# Altium schematic sheet Screen_PCB_250214.SchDoc
size A4; Date: 2025-7-12; DrawnBy: 曹子建; Time: 2025-7-12
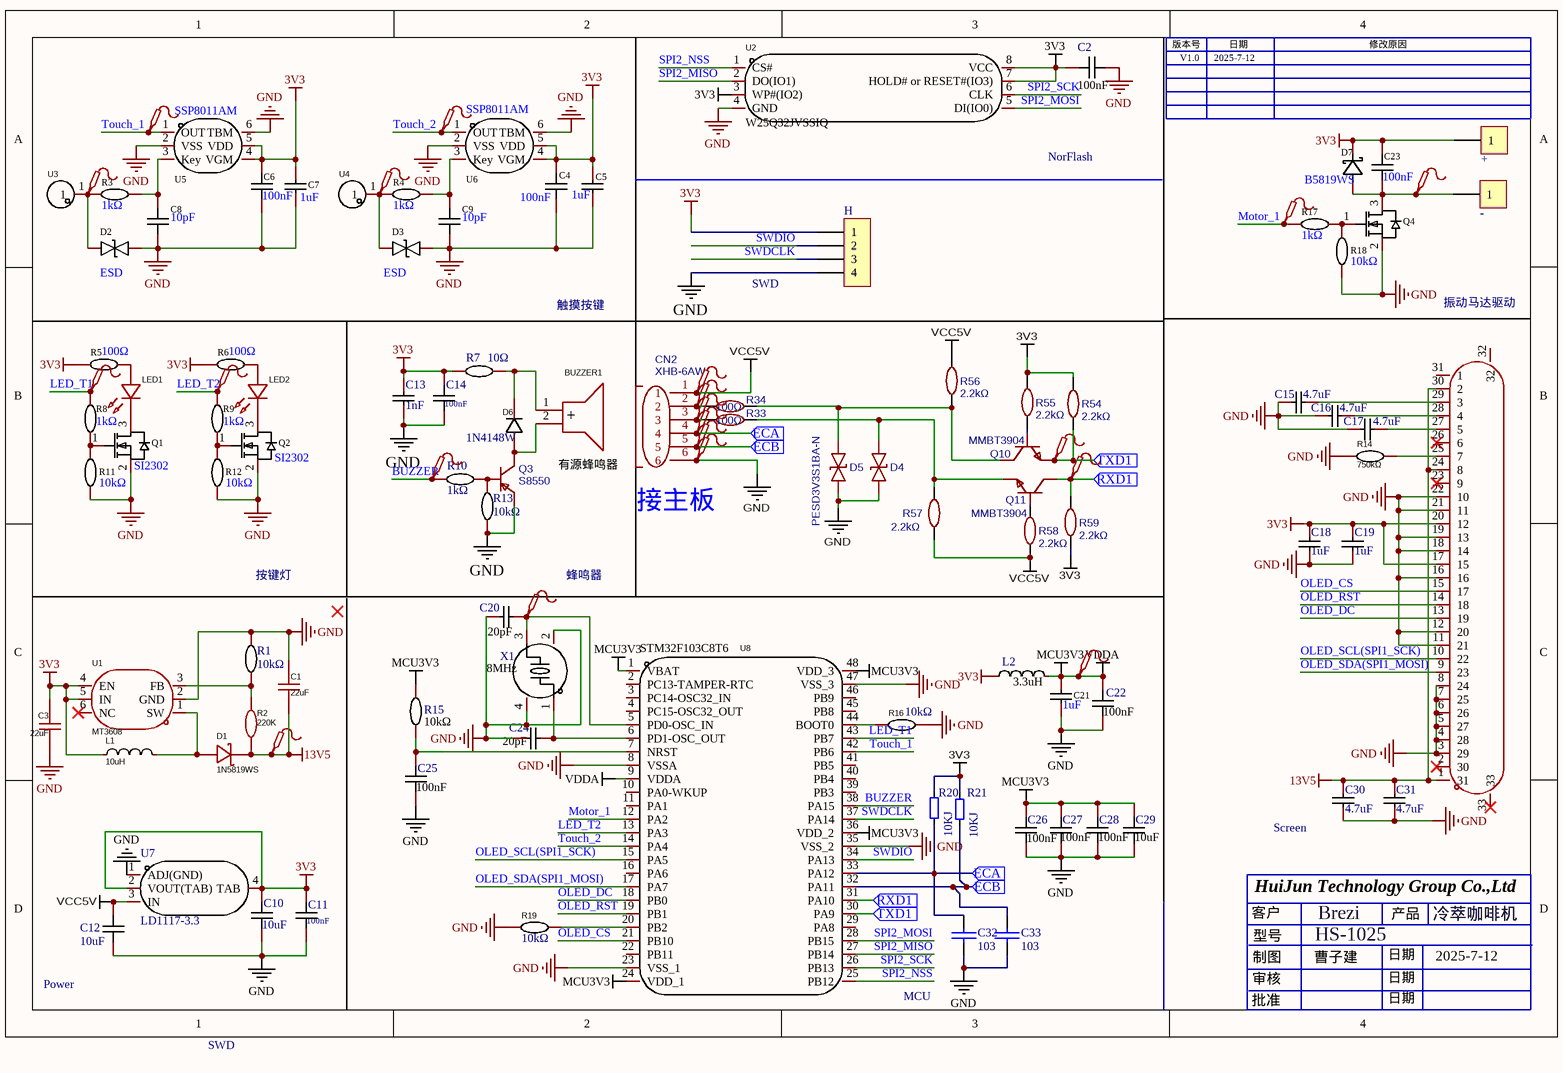
[diagram p0: Screen_PCB_250214.SchDoc]

## Parts
BUZZER1  3kHz  [BUZ-TH_BD9.0-P5.00-D0.6-FD]  (value not drawn)
C1  22uF  [C0603]
C2  Symbol: 100nF  [C0603]  (hidden comment: CL10B104KB8NNNC)
C3  22uF  [C0603]
C4  Symbol: 100nF  [C0603]  (hidden comment: CL10B104KB8NNNC)
C5  Name: 1uF  [C0603]  (hidden comment: 0603B105K250NT)
C6  Symbol: 100nF  [C0603]  (hidden comment: CL10B104KB8NNNC)
C7  Name: 1uF  [C0603]  (hidden comment: 0603B105K250NT)
C8  value 10pF  [C0603]  (hidden comment: 0603CG100J500NT)
C9  value 10pF  [C0603]  (hidden comment: 0603CG100J500NT)
C10  Name: 10uF  [C0805]  (hidden comment: CL21A226MAQNNNE_C45783)
C11  Symbol: 100nF  [C0603]  (hidden comment: CL10B104KB8NNNC)
C12  Name: 10uF  [C0805]  (hidden comment: CL21A226MAQNNNE_C45783)
C13  Name: 1nF  [C0603]  (hidden comment: CC0603KRX7R9BB102)
C14  Symbol: 100nF  [C0603]  (hidden comment: CL10B104KB8NNNC)
C15  Name: 4.7uF  [C0805]  (hidden comment: CL21B475KAFNNNE)
C16  Name: 4.7uF  [C0805]  (hidden comment: CL21B475KAFNNNE)
C17  Name: 4.7uF  [C0805]  (hidden comment: CL21B475KAFNNNE)
C18  Name: 1uF  [C0603]  (hidden comment: 0603B105K250NT)
C19  Name: 1uF  [C0603]  (hidden comment: 0603B105K250NT)
C20  Name: 20pF  [C0603]  (hidden comment: CC0603JRNPO9BN200)
C21  Name: 1uF  [C0603]  (hidden comment: 0603B105K250NT)
C22  Symbol: 100nF  [C0603]  (hidden comment: CL10B104KB8NNNC)
C23  Symbol: 100nF  [C0603]  (hidden comment: CL10B104KB8NNNC)
C24  Name: 20pF  [C0603]  (hidden comment: CC0603JRNPO9BN200)
C25  Symbol: 100nF  [C0603]  (hidden comment: CL10B104KB8NNNC)
C26  Symbol: 100nF  [C0603]  (hidden comment: CL10B104KB8NNNC)
C27  Symbol: 100nF  [C0603]  (hidden comment: CL10B104KB8NNNC)
C28  Symbol: 100nF  [C0603]  (hidden comment: CL10B104KB8NNNC)
C29  Name: 10uF  [C0603]  (hidden comment: CL10A106KP8NNNC)
C30  Name: 4.7uF  [C0805]  (hidden comment: CL21B475KAFNNNE)
C31  Name: 4.7uF  [C0805]  (hidden comment: CL21B475KAFNNNE)
C32  103  [C0603]
C33  103  [C0603]
CN2  XHB-6AW  [CONN-SMD_6P-P1.25_HC-1.25-6PLT]
D1  1N5819WS  [SOD-323_L1.8-W1.3-LS2.5-RD]
D2  Type: ESD  [D0603-BI]  (hidden comment: BESDU0603-14)
D3  Type: ESD  [D0603-BI]  (hidden comment: BESDU0603-14)
D4  PESD3V3S1BA-N  [SOD-523_L1.2-W0.8-LS1.6-BI]
D5  PESD3V3S1BA-N  [SOD-523_L1.2-W0.8-LS1.6-BI]  (value not drawn)
D6  1N4148W  [SOD-123_L2.8-W1.8-LS3.7-RD]
D7  B5819WS  [SOD-323_L1.7-W1.3-LS2.5-FD]
FPC1  0.3K-HX-31PWB  [FPC-SMD_31P-P0.30_HDGC_0.3K-HX-31PWB]  (value not drawn)
H  CON4  [SIP4-2.54]  (value not drawn)
L1  10uH  [IND-SMD_L4.0-W4.0]
L2  Name: 3.3uH  [L0603]  (hidden comment: MLF1608A3R3JT000)
LED1  67-21S/KK7C-H507034Z15/DT(GC)  [LED-SMD_L3.5-W2.8-FD-2835_WHITE]  (value not drawn)
LED2  67-21S/KK7C-H507034Z15/DT(GC)  [LED-SMD_L3.5-W2.8-FD-2835_WHITE]  (value not drawn)
Q1  SI2302  [SOT-23_L2.9-W1.3-P1.90-LS2.4-BR]
Q2  SI2302  [SOT-23_L2.9-W1.3-P1.90-LS2.4-BR]
Q3  S8550  [SOT-23_L2.9-W1.3-P0.95-LS2.4-BR]
Q4  SI2302_C2938373  [SOT-23_L2.9-W1.3-P1.90-LS2.4-BR]  (value not drawn)
Q10  MMBT3904  [SOT-23-3_L2.9-W1.3-P1.90-LS2.4-BR]
Q11  MMBT3904  [SOT-23-3_L2.9-W1.3-P1.90-LS2.4-BR]
R1  Name: 10kΩ  [R0603]  (hidden comment: 180kΩ)
R2  220K  [R0603]
R3  Name: 1kΩ  [R0603]  (hidden comment: RC0603FR-071KL)
R4  Name: 1kΩ  [R0603]  (hidden comment: RC0603FR-071KL)
R5  Name: 100Ω  [R0603]  (hidden comment: RC0603FR-07100RL)
R6  Name: 100Ω  [R0603]  (hidden comment: RC0603FR-07100RL)
R7  Name: 10Ω  [R0603]  (hidden comment: 0603WAF100JT5E)
R8  Name: 1kΩ  [R0603]  (hidden comment: RC0603FR-071KL)
R9  Name: 1kΩ  [R0603]  (hidden comment: RC0603FR-071KL)
R10  1kΩ  [R0603]
R11  10kΩ  [R0603]
R12  10kΩ  [R0603]
R13  10kΩ  [R0603]
R14  value 750kΩ  [R0603]  (hidden comment: 0603WAF7503T5E)
R15  10kΩ  [R0603]
R16  value 10kΩ  [R0603]  (hidden comment: 0603WAF1002T5E)
R17  Name: 1kΩ  [R0603]  (hidden comment: RC0603FR-071KL)
R18  10kΩ  [R0603]
R19  value 10kΩ  [R0603]  (hidden comment: 0603WAF1002T5E)
R20  10KJ  [R0603]
R21  10KJ  [R0603]
R33  100Ω  [R0603]
R34  100Ω  [R0603]
R54  2.2kΩ  [R0603]
R55  2.2kΩ  [R0603]
R56  2.2kΩ  [R0603]
R57  2.2kΩ  [R0603]
R58  2.2kΩ  [R0603]
R59  2.2kΩ  [R0603]
T1  +  [1.5MM测试点]
T2  -  [1.5MM测试点]
TP1  Test-Point  [Test-Point-0.5mm]  (value not drawn)
TP2  Test-Point  [Test-Point-0.5mm]  (value not drawn)
TP3  Test-Point  [Test-Point-0.5mm]  (value not drawn)
TP4  Test-Point  [Test-Point-0.5mm]  (value not drawn)
TP5  Test-Point  [Test-Point-0.5mm]  (value not drawn)
TP6  Test-Point  [Test-Point-0.5mm]  (value not drawn)
TP7  Test-Point  [Test-Point-0.5mm]  (value not drawn)
TP8  Test-Point  [Test-Point-0.5mm]  (value not drawn)
TP9  Test-Point  [Test-Point-0.5mm]  (value not drawn)
TP10  Test-Point  [Test-Point-0.5mm]  (value not drawn)
TP11  Test-Point  [Test-Point-0.5mm]  (value not drawn)
TP12  Test-Point  [Test-Point-0.5mm]  (value not drawn)
TP13  Test-Point  [Test-Point-0.5mm]  (value not drawn)
TP15  Test-Point  [Test-Point-0.5mm]  (value not drawn)
TP16  Test-Point  [Test-Point-0.5mm]  (value not drawn)
TP17  Test-Point  [Test-Point-0.5mm]  (value not drawn)
TP18  Test-Point  [Test-Point-0.5mm]  (value not drawn)
TP19  Test-Point  [Test-Point-0.5mm]  (value not drawn)
TP20  Test-Point  [Test-Point-0.5mm]  (value not drawn)
TP21  Test-Point  [Test-Point-0.5mm]  (value not drawn)
U1  MT3608  [SOT-23-6_L2.9-W1.6-P0.95-LS2.8-BL]
U2  W25Q32JVSSIQ  [SOIC-8_L5.3-W5.3-P1.27-LS8.0-BL]
U3  F10-8-7-0.4  [F6.5-10-4.5-0.5Z]  (value not drawn)
U4  F10-8-7-0.4  [F6.5-10-4.5-0.5Z]  (value not drawn)
U5  SSP8011AM  [SOT-23-6_L2.9-W1.7-P0.95-LS2.8-BL]
U6  SSP8011AM  [SOT-23-6_L2.9-W1.7-P0.95-LS2.8-BL]
U7  LD1117-3.3  [SOT-223_L6.7-W3.5-P2.30-BR]
U8  STM32F103C8T6  [LQFP-48_L7.0-W7.0-P0.50-LS9.0-BL]
X1  Name: 8MHz  [CRYSTAL-SMD_4P-L3.2-W2.5-BL]  (hidden comment: X32258MSB4SI)

## Ports
ECA (in), ECB (in), RXD1 (in), TXD1 (in)

## Nets
3V3: C2.2 C3.2 C4.2 C5.2 C6.2 C7.2 C10.2 C11.1 C13.2 C14.1 C18.2 C19.2 C23.1 D7.2(K) FPC1.17(15) FPC1.20(12) H.1 L1.1 L2.1 R5.2 R6.2 R7.1 R20.1 R21.2 R54.2 R55.2 R59.1 T1.1 U1.4(EN) U1.5(IN) U2.3(WP#(IO2)) U2.7(HOLD#_or_RESET#(IO3)) U2.8(VCC) U5.4(VGM) U5.5(VDD) U6.4(VGM) U6.5(VDD) U7.2(VOUT(TAB)) U7.4(TAB)
13V5: C1.1 C30.2 C31.2 D1.1(K) FPC1.1(31) FPC1.24(8) FPC1.30(2) R2.1 TP21.1
GND: C1.2 C2.1 C3.1 C4.1 C5.1 C6.1 C7.1 C8.1 C9.1 C10.1 C11.2 C12.1 C13.1 C14.2 C15.1 C16.1 C17.1 C18.1 C19.1 C20.1 C21.1 C22.1 C24.1 C25.1 C26.1 C27.1 C28.1 C29.1 C30.1 C31.1 C32.2 C33.2 CN2.6 D2.2 D3.2 D4.1 D5.1 FPC1.3(29) FPC1.4(28) FPC1.5(27) FPC1.6(26) FPC1.7(25) FPC1.8(24) FPC1.11(21) FPC1.12(20) FPC1.16 FPC1.18(14) FPC1.19(13) FPC1.21(11) FPC1.22(10) H.4 Q1.2(S) Q2.2(S) Q3.2(E) Q4.2(S) R1.2 R11.2 R12.2 R13.2 R14.1 R16.1 R18.2 R19.1 TP6.1 U1.2(GND) U2.4(GND) U5.2(VSS) U5.6(TBM) U6.2(VSS) U6.6(TBM) U7.1(ADJ(GND)) U8.8(VSSA) U8.23(VSS_1) U8.35(VSS_2) U8.47(VSS_3) X1.2(GND) X1.4(GND)
MCU3V3: C21.2 C22.2 C26.2 C27.2 C28.2 C29.2 L2.2 R15.1 TP7.1 U8.1(VBAT) U8.9(VDDA) U8.24(VDD_1) U8.36(VDD_2) U8.48(VDD_3)  [also labelled VDDA]
VCC5V: C12.2 CN2.1 R56.2 R57.1 R58.1 TP1.1 U7.3(IN)
BUZZER: R10.1 TP11.1 U8.38(PA15)
ECA: C32.1 CN2.4 R20.2 TP4.1 U8.33(PA12) ; port ECA
ECB: C33.1 CN2.5 R21.1 TP5.1 U8.32(PA11) ; port ECB
LED_T1: R8.2 TP13.1 U8.43(PB7)
LED_T2: R9.2 TP12.1 U8.13(PA3)
Motor_1: R17.1 TP16.1 U8.12(PA2)
OLED_CS: FPC1.15(17) U8.21(PB10)
OLED_DC: FPC1.13(19) U8.18(PB0)
OLED_RST: FPC1.14(18) U8.19(PB1)
OLED_SCL(SPI1_SCK): FPC1.10(22) U8.15(PA5)
OLED_SDA(SPI1_MOSI): FPC1.9(23) U8.17(PA7)
RXD1: Q11.3(C) R59.2 TP9.1 U8.31(PA10) ; port RXD1
SPI2_MISO: U2.2(DO(IO1)) U8.27(PB14)
SPI2_MOSI: U2.5(DI(IO0)) U8.28(PB15)
SPI2_NSS: U2.1(CS#) U8.25(PB12)
SPI2_SCK: U2.6(CLK) U8.26(PB13)
SWDCLK: H.3 U8.37(PA14)
SWDIO: H.2 U8.34(PA13)
Touch_1: TP18.1 U5.1(OUT) U8.42(PB6)
Touch_2: TP20.1 U6.1(OUT) U8.14(PA4)
TXD1: Q10.2(E) R54.1 TP8.1 U8.30(PA9) ; port TXD1
NetBUZZER1_1: BUZZER1.1(+) D6.1(K) R7.2
NetBUZZER1_2: BUZZER1.2(-) D6.2(A) Q3.3(C)
NetC8_2: C8.2 R3.2 U5.3(Key)
NetC9_2: C9.2 R4.2 U6.3(Key)
NetC15_2: C15.2 FPC1.29(3)
NetC16_2: C16.2 FPC1.28(4)
NetC17_2: C17.2 FPC1.27(5)
NetC20_2: C20.2 TP10.1 U8.5(PD0-OSC_IN) X1.3
NetC23_2: C23.2 D7.1(A) Q4.3(D) T2.1 TP15.1
NetC24_2: C24.2 U8.6(PD1-OSC_OUT) X1.1
NetC25_2: C25.2 R15.2 U8.7(NRST)
NetCN2_2: CN2.2 R34.1 TP2.1
NetCN2_3: CN2.3 R33.1 TP3.1
NetD1_2: D1.2(A) L1.2 U1.1(SW)
NetD2_1: D2.1 R3.1 TP17.1 U3.1
NetD3_1: D3.1 R4.1 TP19.1 U4.1
NetD4_2: D4.2 Q11.2(E) R33.2 R57.2
NetD5_2: D5.2 Q10.3(C) R34.2 R56.1
NetFPC1_25: FPC1.25(7) R14.2
NetLED1_1: LED1.1 Q1.3(D)
NetLED1_2: LED1.2 R5.1
NetLED2_1: LED2.1 Q2.3(D)
NetLED2_2: LED2.2 R6.1
NetQ1_1: Q1.1(G) R8.1 R11.1
NetQ2_1: Q2.1(G) R9.1 R12.1
NetQ3_1: Q3.1(B) R10.2 R13.1
NetQ4_1: Q4.1(G) R17.2 R18.1
NetQ10_1: Q10.1(B) R55.1
NetQ11_1: Q11.1(B) R58.2
NetR1_1: R1.1 R2.2 U1.3(FB)
NetR16_2: R16.2 U8.44(BOOT0)
NetR19_2: R19.2 U8.20(PB2)

Not connected (* = marked no-connect by the designer): FPC1 2(30)* 23(9)* 26(6)* 31(1) 32 33*; U1 6(NC)*; U8 2(PC13-TAMPER-RTC) 3(PC14-OSC32_IN) 4(PC15-OSC32_OUT) 10(PA0-WKUP) 11(PA1) 16(PA6) 22(PB11) 29(PA8) 39(PB3) 40(PB4) 41(PB5) 45(PB8) 46(PB9)

## Notes on the sheet
- NorFlash
- 触摸按键
- SWD
- (near FPC1) 振动马达驱动
- 有源蜂鸣器
- 接主板
- 按键灯
- 蜂鸣器
- (near C30) Screen
- Brezi
- 冷萃咖啡机
- (near C12) Power
- HS-1025
- MCU
- 版本号
- 日期
- 修改原因
- V1.0
- 客户
- HuiJun Technology Group Co.,Ltd
- 产品
- 审核
- 制图
- 型号
- 批准

## Library data of the parts
BUZZER1 = HNB09A03: Manufacturer: 华能; Add into BOM: yes; Oscillator Circuit: 有源(内含驱动线路); Technology Type: 电磁式; Operating Voltage: 1.5V~4.5V; Current Consumption: 30mA; Sound Pressure Level (SPL): 85dB@10cm; Symbol: HNB09A03; Device: HNB09A03; LCSC Part Name: 电磁式有源一体蜂鸣器HNB09A03; Supplier Part: C96102; Manufacturer Part: HNB09A03; Supplier Footprint: 插件,D=9mm; JLCPCB Part Class: Extended Part; Datasheet: https://atta.szlcsc.com/upload/public/pdf/source/20170522/1495448326172.pdf; Supplier: LCSC; Convert to PCB: yes; Value: 3kHz; Diameter (φD): 9mm; Length: -; Width: -; Height: 5.5mm; Operating Temperature: -20℃~+70℃
C1 C3 = HGC0603R5226M100NTHJ: Manufacturer: Chinocera(华瓷); Add into BOM: yes; Tolerance: ±20%; Voltage Rated: 10V; Temperature Coefficient: X5R; Symbol: HGC0603R5226M100NTHJ; Device: HGC0603R5226M100NTHJ; Supplier Part: C7432770; Manufacturer Part: HGC0603R5226M100NTHJ; Supplier Footprint: 0603; JLCPCB Part Class: Extended Part; Datasheet: https://atta.szlcsc.com/upload/public/pdf/source/20240320/FAC3FEC40A78BC5CCCE96C232A94D860.pdf; Supplier: LCSC; Convert to PCB: yes; Value: 22uF
  C1: LCSC Part Name: 22uF ±20% 16V
  C3: LCSC Part Name: 22uF ±20% 10V
C2 C4 C6 C11 C14 C22 C23 C25-C28 = CL10B104KB8NNNC: Manufacturer: SAMSUNG(三星); Convert to PCB: yes; value: 100nF; Name: CL10B104KB8NNNC; Device: CL10B104KB8NNNC; Supplier: LCSC; Manufacturer Part: CL10B104KB8NNNC; Supplier Part: C1591; JLCPCB Part Class: Extended Part; Add into BOM: yes; Origin Footprint: C0603
C5 C7 C18 C19 C21 = 0603B105K250NT: Manufacturer: FH(风华); Add into BOM: yes; Value: 1uF; Tolerance: ±10%; Voltage Rated: 25V; Temperature Coefficient: X7R; Symbol: 0603B105K250NT; Device: 0603B105K250NT; LCSC Part Name: 1uF ±10% 25V; Supplier Part: C59302; Manufacturer Part: 0603B105K250NT; Supplier Footprint: 0603; JLCPCB Part Class: 扩展库; Datasheet: https://atta.szlcsc.com/upload/public/pdf/source/20170923/C59302_1506149498957988854.pdf; Supplier: LCSC; Convert to PCB: yes
C8 C9 = 0603CG100J500NT: Manufacturer: FH(风华); Add into BOM: yes; Tolerance: ±5%; Voltage Rated: 50V; Temperature Coefficient: C0G; Symbol: 0603CG100J500NT; Device: 0603CG100J500NT; LCSC Part Name: 10pF ±5% 50V; Supplier Part: C91367; Manufacturer Part: 0603CG100J500NT; Supplier Footprint: 0603; JLCPCB Part Class: Extended Part; Datasheet: https://atta.szlcsc.com/upload/public/pdf/source/20200305/C486355_26A10D38EF8C2A5C37091D0039909270.pdf; Supplier: LCSC; Convert to PCB: yes
C10 C12 = CL21A226MAQNNNE_C45783: Manufacturer: SAMSUNG(三星); Add into BOM: yes; Value: 10uF; Tolerance: ±20%; Voltage Rated: 25V; Temperature Coefficient: X5R; Symbol: CL21A226MAQNNNE; Device: CL21A226MAQNNNE_C45783; LCSC Part Name: 22uF ±20% 25V; Supplier Part: C45783; Manufacturer Part: CL21A226MAQNNNE; Supplier Footprint: 0805; JLCPCB Part Class: Basic Part; Datasheet: https://atta.szlcsc.com/upload/public/pdf/source/20160103/1457707727161.pdf; Supplier: LCSC; Convert to PCB: yes
C13 = CC0603KRX7R9BB102: Manufacturer: YAGEO(国巨); Add into BOM: yes; Value: 1nF; Tolerance: ±10%; Voltage Rated: 50V; Temperature Coefficient: X7R; Symbol: CC0603KRX7R9BB102; Device: CC0603KRX7R9BB102; LCSC Part Name: 1nF ±10% 50V; Supplier Part: C100040; Manufacturer Part: CC0603KRX7R9BB102; Supplier Footprint: 0603; JLCPCB Part Class: Extended Part; Datasheet: https://atta.szlcsc.com/upload/public/pdf/source/20170420/1492670664651.pdf; Supplier: LCSC; Convert to PCB: yes
C15-C17 C30 C31 = CL21B475KAFNNNE: Manufacturer: SAMSUNG(三星); Add into BOM: yes; Value: 4.7uF; Tolerance: ±10%; Voltage Rated: 25V; Temperature Coefficient: X7R; Symbol: CL21B475KAFNNNE; Device: CL21B475KAFNNNE; LCSC Part Name: 4.7uF ±10% 25V; Supplier Part: C98195; Manufacturer Part: CL21B475KAFNNNE; Supplier Footprint: 0805; JLCPCB Part Class: Extended Part; Datasheet: https://atta.szlcsc.com/upload/public/pdf/source/20170412/1491969153531.pdf; Supplier: LCSC; Convert to PCB: yes
C20 C24 = CC0603JRNPO9BN200: Manufacturer: YAGEO(国巨); Add into BOM: yes; Value: 20pF; Tolerance: ±5%; Voltage Rated: 50V; Temperature Coefficient: NP0; Symbol: CC0603JRNPO9BN200; Device: CC0603JRNPO9BN200; LCSC Part Name: 20pF ±5% 50V; Supplier Part: C105621; Manufacturer Part: CC0603JRNPO9BN200; Supplier Footprint: 0603; JLCPCB Part Class: Extended Part; Datasheet: https://atta.szlcsc.com/upload/public/pdf/source/20170425/1493115771885.pdf; Supplier: LCSC; Convert to PCB: yes
C29 = CL10A106KP8NNNC: Manufacturer: SAMSUNG(三星); Add into BOM: yes; Value: 10uF; Tolerance: ±10%; Voltage Rated: 10V; Temperature Coefficient: X5R; Symbol: CL10A106KP8NNNC; Device: CL10A106KP8NNNC; LCSC Part Name: 10uF ±10% 10V; Supplier Part: C19702; Manufacturer Part: CL10A106KP8NNNC; Supplier Footprint: 0603; JLCPCB Part Class: Basic Part; Datasheet: https://atta.szlcsc.com/upload/public/pdf/source/20160103/1457707703378.pdf; Supplier: LCSC; Convert to PCB: yes
C32 C33 = CAP: Capacitor; 规格型号: 104-50V-J-X7R-0805; 品名: 贴片电容
CN2 = XHB-6AW: Manufacturer: BOOMELE(博穆精密); Supplier: LCSC; Manufacturer Part: XHB-6AW; Supplier Part: C66056; JLCPCB Part Class: Extended Part; spicePre: C; spiceSymbolName: XHB-6AW
D1 = 1N5819WS_C191023: Manufacturer: Hottech(合科泰); Add into BOM: yes; Forward Voltage (Vf@If): 600mV@1A; Reverse Voltage (Vr): 40V; Average Rectified Current (Io): 1A; Symbol: 1N5819WS; Device: 1N5819WS_C191023; LCSC Part Name: 电压:40V 电流:1A; Supplier Part: C191023; Manufacturer Part: 1N5819WS; Supplier Footprint: SOD-323; JLCPCB Part Class: Basic Part; Datasheet: https://atta.szlcsc.com/upload/public/pdf/source/20220428/3CB86FD8D28D653594B4E35F9D5AEFD9.pdf; Supplier: LCSC; Convert to PCB: yes
D2 D3 = BESDU0603-14: Manufacturer: BORN(伯恩半导体); Add into BOM: yes; polarity: 双向; Reverse Stand-Off Voltage (Vrwm): 14V; Maximum Clamping Voltage: 30V; Symbol: BESDU0603-14; Device: BESDU0603-14; Supplier: LCSC; Supplier Part: C316058; Manufacturer Part: BESDU0603-14; JLCPCB Part Class: Extended Part; Supplier Footprint: 0603; Datasheet: https://atta.szlcsc.com/upload/public/pdf/source/20181026/C316058_8CD36634E742DB91216609B68232011F.pdf; Convert to PCB: yes; LCSC Part Name: 双向ESD
D4 D5 = PESD3V3S1BA-N: Manufacturer: BORN(伯恩半导体); Contributor: LCSC; Supplier: LCSC; Supplier Part: C316037; Manufacturer Part: PESD3V3S1BA-N; JLCPCB Part Class: Extended Part; spicePre: D; spiceSymbolName: PESD3V3S1BA-N
D6 = 1N4148W_C2099: Manufacturer: CJ(江苏长电/长晶); Symbol: 1N4148W T4; Add into BOM: yes; Diode Configuration: 独立式; Forward Voltage (Vf@If): 1.25V@150mA; Reverse Voltage (Vr): 100V; Average Rectified Current (Io): 150mA; Reverse Leakage Current: 1uA@75V; Reverse Recovery Time (trr): 4ns; Device: 1N4148W_C2099; LCSC Part Name: 电压:100V 电流:150mA; Supplier Part: C2099; Manufacturer Part: 1N4148W; Supplier Footprint: SOD-123; JLCPCB Part Class: Extended Part; Datasheet: https://atta.szlcsc.com/upload/public/pdf/source/20120428/1457706480199.pdf; Supplier: LCSC; Convert to PCB: yes; Operating Temperature: -
D7 = B5819WS_C7420331: Manufacturer: 宏迦橙; Add into BOM: yes; Diode Configuration: 独立式; Forward Voltage (Vf@If): 600mV@1.0A; Reverse Voltage (Vr): 40V; Average Rectified Current (Io): 1A; Reverse Leakage Current (Ir): 1mA@40V; Peak forward surge current: 10A; Symbol: B5819WS_C7420331; Device: B5819WS_C7420331; Supplier: LCSC; Supplier Part: C7420331; Manufacturer Part: B5819WS; JLCPCB Part Class: Extended Part; LCSC Part Name: 电压:40V 电流:1A; Supplier Footprint: SOD-323; Datasheet: https://atta.szlcsc.com/upload/public/pdf/source/20230828/03CA0F4F90DAE368A7153B7B5E4D0651.pdf; Convert to PCB: yes
FPC1 = 0.3K-HX-31PWB: Manufacturer: HDGC(华德共创); Add into BOM: yes; Locking Feature: 翻盖式; Number of Contacts: 31P; Pitch: 0.3mm; FFC, FCB Thickness: 0.2mm; Symbol: 0.3K-HX-31PWB; Device: 0.3K-HX-31PWB; LCSC Part Name: 翻盖式 上接 P数:31P 间距:0.3mm; Supplier Part: C2919530; Manufacturer Part: 0.3K-HX-31PWB; Supplier Footprint: SMD,P=0.3mm,卧贴; JLCPCB Part Class: Extended Part; Datasheet: https://atta.szlcsc.com/upload/public/pdf/source/20211115/5A3AC448CFC4AFE5F6E30419C274B007.pdf; Supplier: LCSC; Convert to PCB: yes; Contact Type: 上接; Mounting Type: 卧贴; Height Above Board: 1mm; Operating Temperature Range: -55℃~+85℃
H = CON4: Connector
L1 = YNR4030-100M: Manufacturer: YJYCOIN(益嘉源); Add into BOM: yes; Tolerance: ±20%; Rated Current: 1.5A; DC Resistance (DCR): 100mΩ; Name: 10uH; Symbol: YNR4030-100M; Device: YNR4030-100M; LCSC Part Name: 10uH ±20%; Supplier Part: C340393; Manufacturer Part: YNR4030-100M; Supplier Footprint: SMD,4x4x3mm; JLCPCB Part Class: Extended Part; Datasheet: https://atta.szlcsc.com/upload/public/pdf/source/20200623/C340386_9AA10DB3E9692149FF2BB278AFBCE083.pdf; Supplier: LCSC; Convert to PCB: yes; Value: 10uH
L2 = MLF1608A3R3JT000: Manufacturer: TDK; Add into BOM: yes; Value: 3.3uH; Tolerance: ±5%; Rated Current: 30mA; DC Resistance (DCR): 550mΩ; Q @ Freq: 35@10MHz; Frequency - Self Resonant: 65MHz; Symbol: MLF1608A3R3JT000; Device: MLF1608A3R3JT000; LCSC Part Name: 3.3uH ±5% 30mA 550mΩ; Supplier Part: C275346; Manufacturer Part: MLF1608A3R3JT000; Supplier Footprint: 0603; JLCPCB Part Class: Extended Part; Datasheet: https://atta.szlcsc.com/upload/public/pdf/source/20181029/C275346_55A5DA1768D24AF04FA3EE7572E2034E.pdf; Supplier: LCSC; Convert to PCB: yes; Saturation Current (Isat): -; Ratings: -
LED1 LED2 = 67-21S/KK7C-H507034Z15/DT(GC): Manufacturer: EVERLIGHT(亿光); Add into BOM: yes; Emitted Color: 白色; Power Dissipation: 630mW; Forward Current: 150mA; Lens Color: 无色透明透镜; Color Temperature: 5000K; Viewing Angle: 120°; Symbol: 67-21S/KK7C-H507034Z15/DT(GC); Device: 67-21S/KK7C-H507034Z15/DT(GC); LCSC Part Name: 白灯 色温5000K; Supplier Part: C475394; Manufacturer Part: 67-21S/KK7C-H507034Z15/DT(GC); Supplier Footprint: SMD3528; JLCPCB Part Class: Extended Part; Datasheet: https://atta.szlcsc.com/upload/public/pdf/source/20200720/C475394_1A33B21880A02C6F232734985B355625.pdf; Supplier: LCSC; Convert to PCB: yes; Dominant Wavelength: -; Peak Wavelength: -; Diode Configuration: -; Mounting Sytle: -; Operating Temperature: -40℃~+85℃
Q1 Q2 = SI2302_C2938373: Manufacturer: GOODWORK(固得沃克); Add into BOM: yes; Type: N沟道; Drain Source Voltage (Vdss): 20V; Continuous Drain Current (Id): 4.3A; Power Dissipation (Pd): 1.2W; Drain Source On Resistance (RDS(on)@Vgs,Id): 25mΩ@4.5V,3.6A; Gate Threshold Voltage (Vgs(th)@Id): 700mV@250uA; Total Gate Charge (Qg@Vgs): 5.4nC@4.5V; Input Capacitance (Ciss@Vds): 300pF@10V; Reverse Transfer Capacitance (Crss@Vds): 120pF@10V; Symbol: SI2302_C2938373; Device: SI2302_C2938373; Supplier: LCSC; Supplier Part: C2938373; Manufacturer Part: SI2302; JLCPCB Part Class: Extended Part; LCSC Part Name: N沟道 耐压:20V 电流:4.3A; Supplier Footprint: SOT-23; Datasheet: https://atta.szlcsc.com/upload/public/pdf/source/20211229/100821F66BCD11D4D3CF8AF6E6794D78.pdf; Convert to PCB: yes; Operating Temperature: -
Q3 = PNP-S8550_C397181: BOM_Manufacturer: AnBon; Contributor: jiuwan321; BOM_Supplier: LCSC; BOM_Supplier Part: C397181; BOM_Manufacturer Part: S8550; spicePre: Q; spiceSymbolName: S8550_C397181
Q4 = SI2302_C2938373: Manufacturer: GOODWORK(固得沃克); Manufacturer Part: SI2302; Add into BOM: yes; Type: N沟道; Drain Source Voltage (Vdss): 20V; Continuous Drain Current (Id): 4.3A; Power Dissipation (Pd): 1.2W; Drain Source On Resistance (RDS(on)@Vgs,Id): 25mΩ@4.5V,3.6A; Gate Threshold Voltage (Vgs(th)@Id): 700mV@250uA; Total Gate Charge (Qg@Vgs): 5.4nC@4.5V; Input Capacitance (Ciss@Vds): 300pF@10V; Reverse Transfer Capacitance (Crss@Vds): 120pF@10V; Symbol: SI2302_C2938373; Device: SI2302_C2938373; Supplier: LCSC; Supplier Part: C2938373; JLCPCB Part Class: Extended Part; LCSC Part Name: N沟道 耐压:20V 电流:4.3A; Supplier Footprint: SOT-23; Datasheet: https://atta.szlcsc.com/upload/public/pdf/source/20211229/100821F66BCD11D4D3CF8AF6E6794D78.pdf; Convert to PCB: yes; Operating Temperature: -
Q10 Q11 = MMBT3904: Manufacturer: CJ(江苏长电/长晶); Contributor: 立创EDA官方封装库; Supplier: LCSC; Manufacturer Part: MMBT3904; Supplier Part: C20526; JLCPCB Part Class: Basic Part; spicePre: Q; spiceSymbolName: MMBT3904-C20526
R1 R11-R13 R15 R18 = 0603WAF1002T5E: Manufacturer: UNI-ROYAL(厚声); Resistance: 10K; Convert to PCB: yes; Symbol: 10kΩ; Device: 0603WAF1002T5E; Supplier: LCSC; Manufacturer Part: 0603WAF1002T5E; Supplier Part: C25804; JLCPCB Part Class: Basic Part; Add into BOM: yes; Origin Footprint: R0603
  R11-R13 R15 R18: Name: 10kΩ
R2 = 0603WAF2203T5E: Manufacturer: UNI-ROYAL(厚声); Add into BOM: yes; Tolerance: ±1%; Power(Watts): 100mW; Overload Voltage (Max): 75V; Temperature Coefficient: ±100ppm/℃; Symbol: 0603WAF2203T5E; Device: 0603WAF2203T5E; LCSC Part Name: 220kΩ ±1% 100mW 厚膜电阻; Supplier Part: C22961; Manufacturer Part: 0603WAF2203T5E; Supplier Footprint: 0603; JLCPCB Part Class: Basic Part; Datasheet: https://atta.szlcsc.com/upload/public/pdf/source/20200306/C422600_1E6D84923E4A46A82E41ADD87F860B5C.pdf; Supplier: LCSC; Convert to PCB: yes; Type: 厚膜电阻; Value: 220K; Operating Temperature Range: -55℃~+155℃
R3 R4 R8 R9 R17 = RC0603FR-071KL: Manufacturer: YAGEO(国巨); Add into BOM: yes; Value: 1kΩ; Tolerance: ±1%; Power(Watts): 100mW; Temperature Coefficient: ±100ppm/℃; Overload Voltage (Max): 75V; Symbol: RC0603FR-071KL; Device: RC0603FR-071KL; LCSC Part Name: 1kΩ ±1% 100mW; Supplier Part: C22548; Manufacturer Part: RC0603FR-071KL; Supplier Footprint: 0603; JLCPCB Part Class: Extended Part; Datasheet: https://atta.szlcsc.com/upload/public/pdf/source/20180312/7BD3618A8B6324EA6280B0497A051AB7.pdf; Supplier: LCSC; Convert to PCB: yes; Type: 厚膜电阻; Operating Temperature Range: -55℃~+155℃
R5 R6 = RC0603FR-07100RL: Manufacturer: YAGEO(国巨); Add into BOM: yes; Value: 100Ω; Tolerance: ±1%; Power(Watts): 100mW; Temperature Coefficient: ±100ppm/℃; Overload Voltage (Max): 75V; Symbol: RC0603FR-07100RL; Device: RC0603FR-07100RL; LCSC Part Name: 100Ω ±1% 100mW; Supplier Part: C105588; Manufacturer Part: RC0603FR-07100RL; Supplier Footprint: 0603; JLCPCB Part Class: Extended Part; Datasheet: https://atta.szlcsc.com/upload/public/pdf/source/20170428/1493376742308.pdf; Supplier: LCSC; Convert to PCB: yes; Type: 厚膜电阻; Operating Temperature Range: -55℃~+155℃
R7 = 0603WAF100JT5E: Manufacturer: UNI-ROYAL(厚声); Add into BOM: yes; Value: 10Ω; Tolerance: ±1%; Power(Watts): 100mW; Temperature Coefficient: ±400ppm/℃; Overload Voltage (Max): 75V; Symbol: 0603WAF100JT5E; Device: 0603WAF100JT5E; LCSC Part Name: 10Ω ±1% 100mW; Supplier Part: C22859; Manufacturer Part: 0603WAF100JT5E; Supplier Footprint: 0603; JLCPCB Part Class: Basic Part; Datasheet: https://atta.szlcsc.com/upload/public/pdf/source/20200306/C422600_1E6D84923E4A46A82E41ADD87F860B5C.pdf; Supplier: LCSC; Convert to PCB: yes; Type: 厚膜电阻; Operating Temperature Range: -55℃~+155℃
R10 = RS-03K1001FT: Manufacturer: FH(风华); Resistance: 1K; Convert to PCB: yes; Name: 1kΩ; Symbol: 1kΩ; Device: RS-03K1001FT; Supplier: LCSC; Manufacturer Part: RS-03K1001FT; Supplier Part: C115325; JLCPCB Part Class: Extended Part; Add into BOM: yes; Origin Footprint: R0603
R14 = 0603WAF7503T5E: Manufacturer: UNI-ROYAL(厚声); Add into BOM: yes; Tolerance: ±1%; Power(Watts): 100mW; Overload Voltage (Max): 75V; Temperature Coefficient: ±100ppm/℃; Symbol: 0603WAF7503T5E; Device: 0603WAF7503T5E; LCSC Part Name: 750kΩ ±1% 100mW 厚膜电阻; Supplier Part: C23240; Manufacturer Part: 0603WAF7503T5E; Supplier Footprint: 0603; JLCPCB Part Class: Extended Part; Datasheet: https://atta.szlcsc.com/upload/public/pdf/source/20200306/C422600_1E6D84923E4A46A82E41ADD87F860B5C.pdf; Supplier: LCSC; Convert to PCB: yes; Type: 厚膜电阻; Operating Temperature Range: -55℃~+155℃
R16 R19 = 0603WAF1002T5E_1: Manufacturer: UNI-ROYAL(厚声); Add into BOM: yes; Tolerance: ±1%; Power(Watts): 100mW; Overload Voltage (Max): 75V; Temperature Coefficient: ±100ppm/℃; Symbol: 0603WAF1002T5E; Device: 0603WAF1002T5E; Supplier: LCSC; Manufacturer Part: 0603WAF1002T5E; Supplier Part: C25804; JLCPCB Part Class: Basic Part; LCSC Part Name: 厚膜电阻 10kΩ ±1% 100mW; Supplier Footprint: 0603; Datasheet: https://atta.szlcsc.com/upload/public/pdf/source/20200306/C422600_1E6D84923E4A46A82E41ADD87F860B5C.pdf; Convert to PCB: yes; Type: 厚膜电阻; Operating Temperature Range: -55℃~+155℃
R20 R21 = RES-SMD: 规格型号: 1K-J-0805; 品名: 贴片电阻
R33 R34 = 100Ω: Manufacturer: UNI-ROYAL(厚声); Manufacturer Part: 0603WAF1000T5E; nameAlias: Value; Supplier: LCSC; Supplier Part: C22775; JLCPCB Part Class: Basic Part; spicePre: R; spiceSymbolName: 0603WAF1000T5E
R54-R59 = 2.2kΩ: Manufacturer: UNI-ROYAL(厚声); Manufacturer Part: 0603WAF2201T5E; nameAlias: Value; Supplier: LCSC; Supplier Part: C4190; JLCPCB Part Class: Basic Part; spicePre: R; spiceSymbolName: 0603WAF2201T5E
T1 T2 = CON1: Connector
TP1-TP13 TP15-TP21 = Test-Point: Test Point 测试点; Add into BOM: yes; Symbol: Test-Point; Device: Test-Point; Convert to PCB: yes; Comment_1: Test-Point
U1 = MT3608: Manufacturer: 西安航天民芯; Add into BOM: yes; Function: 升压型; Input Voltage: 2V~24V; Output Voltage: 28V; Switching Frequency: 1.2MHz; Number of Outputs: 1; Topology: 升压式; Switch tube (built-in/external): 内置; Symbol: MT3608; Device: MT3608; LCSC Part Name: MT3608; Supplier Part: C84817; Manufacturer Part: MT3608; Supplier Footprint: SOT-23-6; JLCPCB Part Class: Extended Part; Datasheet: https://atta.szlcsc.com/upload/public/pdf/source/20161110/1478743351706.pdf; Supplier: LCSC; Convert to PCB: yes; Output Current (Max): -; Synchronous Rectification: -
U2 = W25Q32JVSSIQ: Manufacturer: WINBOND(华邦); Symbol: W25Q32JVSSIQ_C179173; Add into BOM: yes; Device: W25Q32JVSSIQ; LCSC Part Name: W25Q32JVSSIQ; Supplier Part: C179173; Manufacturer Part: W25Q32JVSSIQ; Supplier Footprint: SOIC-8-208mil; JLCPCB Part Class: Extended Part; Datasheet: https://atta.szlcsc.com/upload/public/pdf/source/20191218/C179173_5BBD793D2D7B3672E140BC7AE85C11FF.pdf; Supplier: LCSC; Convert to PCB: yes
U3 U4 = F6.5-10-4.6-0.5Z: Manufacturer: Sam&wing(芯网); Add into BOM: yes; model: -；-; material quality: 碳钢; Wire diameter: 0.4mm; surface treatment: 镀镍; Symbol: F10-8-7-0.4; Device: F10-8-7-0.4; Supplier: LCSC; Supplier Part: C3015091; Manufacturer Part: F10-8-7-0.4; JLCPCB Part Class: Extended Part; LCSC Part Name: 五金; Supplier Footprint: -; Datasheet: https://atta.szlcsc.com/upload/public/pdf/source/20220513/2CFF931039CCE3C1D90D240605B5E48E.pdf; Convert to PCB: yes; brand: -
U5 U6 = SSP8011AM: Manufacturer: Siproin(上海矽朋); Add into BOM: yes; The Channel Number: 1; Operating Voltage: 2.3V~5.5V; Operating Current: 2.5uA; Symbol: SSP8011AM; Device: SSP8011AM; LCSC Part Name: SSP8011AM; Supplier Part: C5199844; Manufacturer Part: SSP8011AM; Supplier Footprint: SOT-23-6; JLCPCB Part Class: Extended Part; Datasheet: https://atta.szlcsc.com/upload/public/pdf/source/20221017/5837C23D426CD5E3FDDC41CF96A30AF0.pdf; Supplier: LCSC; Convert to PCB: yes; Chip Function: -; Whether the Lock: -; Operating Temperature: -20℃~+85℃
U7 = LD1117-3.3: Manufacturer: UMW(广东友台半导体); Add into BOM: yes; Output Type: 固定; Output Polarity: 正; Number of Outputs: 1; Maximum Input Voltage: 18V; Output Voltage: 3.3V; Dropout Voltage: 1.3V@(1A); Output Current: 1A; Power Supply Rejection Ratio (PSRR): 60dB@(120Hz); Name: LD1117-3.3; Symbol: LD1117-3.3; Device: LD1117-3.3; LCSC Part Name: LD1117-3.3; Supplier Part: C347229; Manufacturer Part: LD1117-3.3; Supplier Footprint: SOT-223; JLCPCB Part Class: Extended Part; Datasheet: https://atta.szlcsc.com/upload/public/pdf/source/20211011/06E20BA377003AEB3CF1ECA411AE2B4F.pdf; Supplier: LCSC; Convert to PCB: yes
U8 = STM32F103C8T6: Manufacturer: ST(意法半导体); Add into BOM: yes; CPU Core: ARM-M3; Program Storage Size: 64KB; RAM Size: 20KB; GPIO Ports Number: 37; Operating Voltage Range: 2V~3.6V; CPU Maximum Speed: 72MHz; Program Memory Type: FLASH; ADC (Bit): 12bit; Universal Serial Bus: 有; Peripheral/Function: 看门狗；DMA；看门狗；温度传感器; Name: STM32F103C8T6; Symbol: STM32F103C8T6; Device: STM32F103C8T6; LCSC Part Name: 主流增强型ARM Cortex-M3 MCU，具有64 KB Flash、72 MHz CPU、电机控制、USB和CAN; Supplier Part: C8734; Manufacturer Part: STM32F103C8T6; Supplier Footprint: LQFP-48(7x7); JLCPCB Part Class: Extended Part; Datasheet: https://atta.szlcsc.com/upload/public/pdf/source/20220812/8363ACEC51AD55ECEB84799464F7CB85.pdf; Supplier: LCSC; Convert to PCB: yes; Operating Temperature Range: -40℃~+85℃; DAC (Bit): -; PWM (Bit): -; Internal Comparator: -; communication protocol: -; Watchdog: 有; Real-Time Clock: -; Infrared Data Association: 有; Low-Voltage Detect: 有; CCP Capture/Compare: -; Secure Digital Input and Output: -; Direct Memory Access: 有; Internal Oscillator: 有
X1 = X32258MSB4SI: Manufacturer: YXC(扬兴晶振); Add into BOM: yes; Crystal Type: 贴片无源晶振; Value: 8MHz; Frequency Tolerance: ±10ppm; Frequency Stability: ±30ppm; Load Capacitance: 20pF; Symbol: X32258MSB4SI; Device: X32258MSB4SI; LCSC Part Name: 8MHz ±10ppm 20pF YSX321SL; Supplier Part: C2682774; Manufacturer Part: X32258MSB4SI; Supplier Footprint: SMD3225-4P; JLCPCB Part Class: Extended Part; Datasheet: https://atta.szlcsc.com/upload/public/pdf/source/20210106/C2682774_0CD4FDA5D9DA3FBEEC23BD607A48E4B0.pdf; Supplier: LCSC; Convert to PCB: yes; Operating Temperature: -40℃~+85℃